# EAGLE schematic minsis arduino mcr (EAGLE 9.5.2)
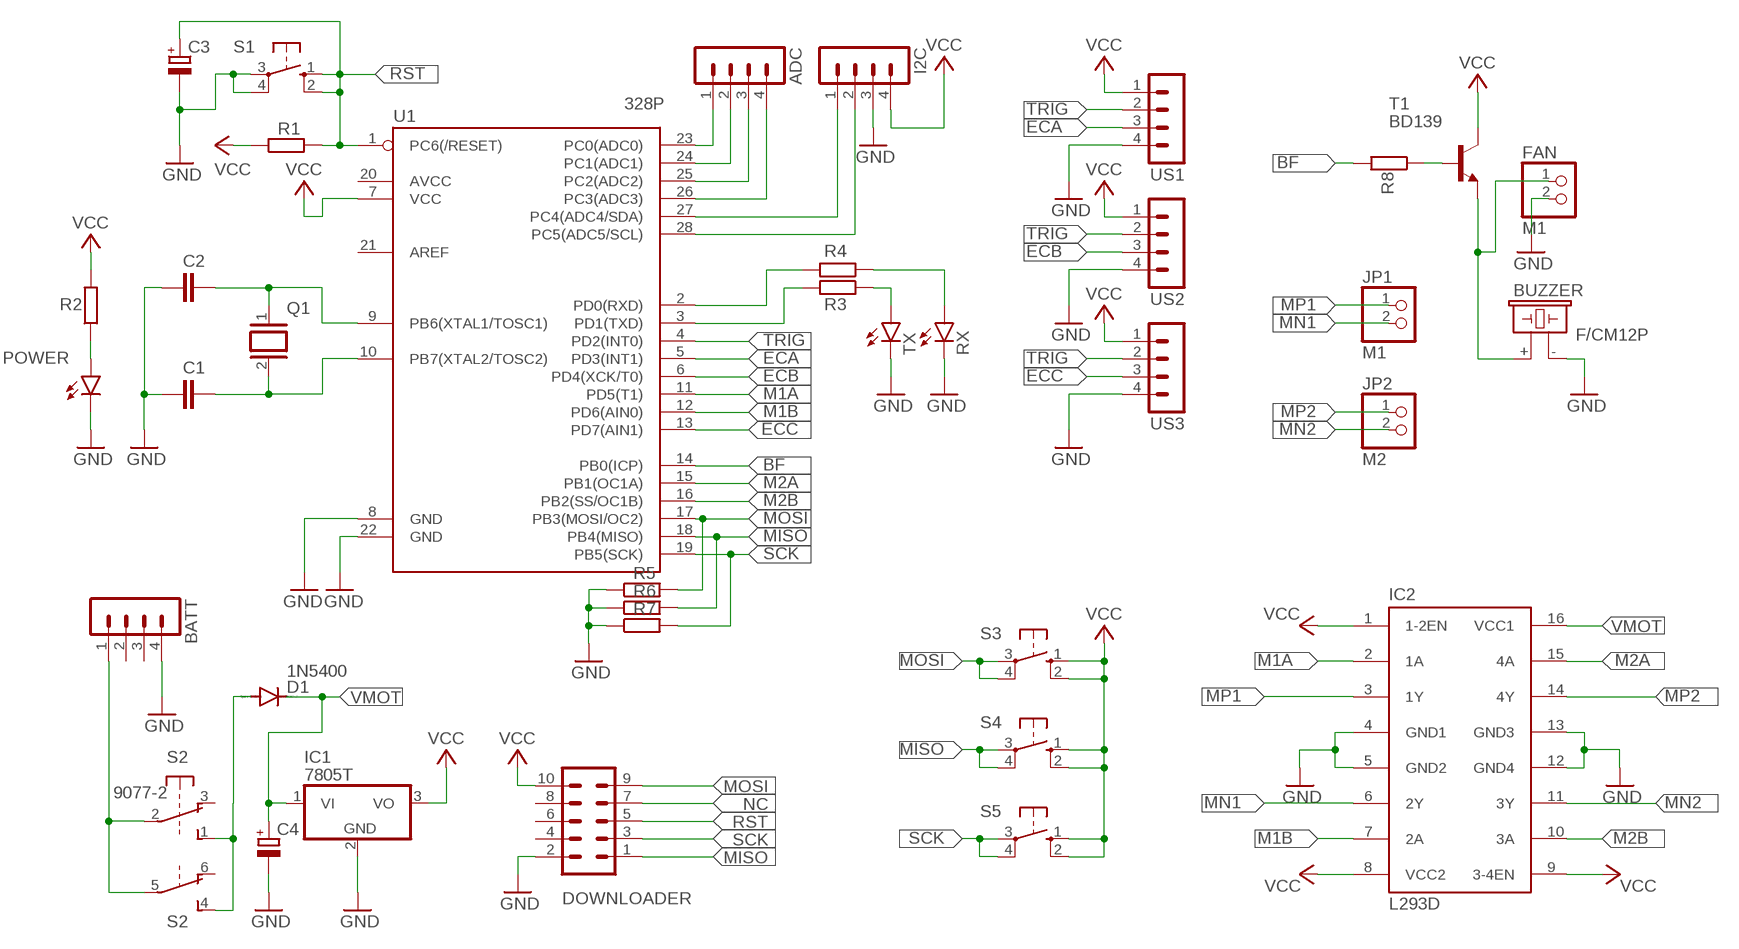
[diagram p0: schematic, sheet 1]

## Parts
ADC  MA04-1  [MA04-1]
BATT  MA04-1  [MA04-1]
BUZZER  F/CM12P  [F/CM12P]
C1  C-EU050-024X044  [C050-024X044]
C2  C-EU050-024X044  [C050-024X044]
C3  CPOL-EUE2,5-6E  [E2,5-6E]
C4  CPOL-EUE3.5-8  [E3,5-8]
D1  1N5400  [DO201-15]
DOWNLOADER  MA05-2  [MA05-2]
FAN  M1  PINHD-1X2  [1X02]
I2C  MA04-1  [MA04-1]
IC1  7805T  [TO220H]
IC2  L293D  [DIL16]
JP1  M1  PINHD-1X2  [1X02]
JP2  M2  PINHD-1X2  [1X02]
POWER  LED3MM  [LED3MM]
Q1  XTAL/S  [QS]
R1  R-EU_0207/7  [0207/7]
R2  R-EU_0207/7  [0207/7]
R3  R-EU_0207/7  [0207/7]
R4  R-EU_0207/7  [0207/7]
R5  R-EU_0207/7  [0207/7]
R6  R-EU_0207/7  [0207/7]
R7  R-EU_0207/7  [0207/7]
R8  R-EU_0207/7  [0207/7]
RX  LED3MM  [LED3MM]
S1  10-XX  [B3F-10XX]
S2  9077-2  [9077-2]
S3  10-XX  [B3F-10XX]
S4  10-XX  [B3F-10XX]
S5  10-XX  [B3F-10XX]
T1  BD139  [TO126]
TX  LED3MM  [LED3MM]
U1  328P  ATMEGA328P_PDIP  [DIP28]
US1  MA04-1  [MA04-1]
US2  MA04-1  [MA04-1]
US3  MA04-1  [MA04-1]

## Nets
BF: R8.2 U1.14(PB0(ICP))
ECA: U1.5(PD3(INT1)) US1.3
ECB: U1.6(PD4(XCK/T0)) US2.3
ECC: U1.13(PD7(AIN1)) US3.3
GND: BATT.4 BUZZER.- C1.1 C2.1 C3.- C4.- DOWNLOADER.2 FAN.2 I2C.3 IC1.2(GND) IC2.4(GND1) IC2.5(GND2) IC2.12(GND4) IC2.13(GND3) POWER.K(C) R5.1 R6.1 R7.1 RX.K(C) S1.3(P) S1.4(P1) TX.K(C) U1.8(GND) U1.22(GND) US1.4 US2.4 US3.4
M1A: IC2.2(1A) U1.11(PD5(T1))
M1B: IC2.7(2A) U1.12(PD6(AIN0))
M2A: IC2.15(4A) U1.15(PB1(OC1A))
M2B: IC2.10(3A) U1.16(PB2(SS/OC1B))
MISO: DOWNLOADER.1 R6.2 S4.3(P) S4.4(P1) U1.18(PB4(MISO))
MN1: IC2.6(2Y) JP1.2
MN2: IC2.11(3Y) JP2.2
MOSI: DOWNLOADER.9 R5.2 S3.3(P) S3.4(P1) U1.17(PB3(MOSI/OC2))
MP1: IC2.3(1Y) JP1.1
MP2: IC2.14(4Y) JP2.1
N$1: R4.1 RX.A
N$2: R3.1 TX.A
N$3: R4.2 U1.2(PD0(RXD))
N$4: R3.2 U1.3(PD1(TXD))
N$5: POWER.A R2.1
N$6: C2.2 Q1.1 U1.9(PB6(XTAL1/TOSC1))
N$7: C1.2 Q1.2 U1.10(PB7(XTAL2/TOSC2))
N$13: BATT.1 S2.2(1:P) S2.5(2:P)
N$22: D1.A S2.1(1:S) S2.4(2:S)
N$23: BUZZER.+ FAN.1 T1.1(E)
N$24: R8.1 T1.3(B)
N$28: ADC.1 U1.23(PC0(ADC0))
N$29: ADC.2 U1.24(PC1(ADC1))
N$30: ADC.3 U1.25(PC2(ADC2))
N$31: ADC.4 U1.26(PC3(ADC3))
N$32: I2C.1 U1.27(PC4(ADC4/SDA))
N$33: I2C.2 U1.28(PC5(ADC5/SCL))
NC: DOWNLOADER.7
RST: C3.+ DOWNLOADER.5 R1.2 S1.1(S) S1.2(S1) U1.1(PC6(/RESET))
SCK: DOWNLOADER.3 R7.2 S5.3(P) S5.4(P1) U1.19(PB5(SCK))
TRIG: U1.4(PD2(INT0)) US1.2 US2.2 US3.2
VCC: DOWNLOADER.10 I2C.4 IC1.3(VO) IC2.1(1-2EN) IC2.8(VCC2) IC2.9(3-4EN) R1.1 R2.2 S3.1(S) S3.2(S1) S4.1(S) S4.2(S1) S5.1(S) S5.2(S1) T1.2(C) U1.7(VCC) US1.1 US2.1 US3.1
VMOT: C4.+ D1.C IC1.1(VI) IC2.16(VCC1)
Unconnected: BATT.2 BATT.3 DOWNLOADER.4 DOWNLOADER.6 DOWNLOADER.8 S2.3(1:O) S2.6(2:O) U1.20(AVCC) U1.21(AREF)

## Library data of the parts
ADC BATT I2C US1-US3 = con-lstb:MA04-1: PIN HEADER; OC_FARNELL: unknown; OC_NEWARK: unknown
BUZZER = buzzer:F/CM12P: BUZZER Source: Buerklin; OC_FARNELL: unknown; OC_NEWARK: unknown
C1 C2 = rcl:C-EU: CAPACITOR, European symbol; SPICEPREFIX: C
C3 C4 = rcl:CPOL-EU: POLARIZED CAPACITOR, European symbol; SPICEPREFIX: C
D1 = diode:1N5400: DIODE standard rectifier, 3 A, 50 V (Motorola)
DOWNLOADER = con-lstb:MA05-2: PIN HEADER; OC_FARNELL: unknown; OC_NEWARK: unknown
FAN JP1 JP2 = Connector:PINHD-1X2: PIN HEADER; CATEGORY: CONNECTOR; SUB-CATEGORY: PIN-HEADER
IC1 = linear:78*: Positive VOLTAGE REGULATOR Source: http://cache.national.com/ds/LM/LM78L05.pdf http://www.fairchildsemi.com/ds/LM/LM7805.pdf
IC2 = st-microelectronics:L293D: PUSH-PULL 4 CHANNEL DRIVER; MPN: L293D; OC_FARNELL: 9589619; OC_NEWARK: 56P8249
POWER RX TX = led:LED: LED OSRAM: - CHIPLED LG R971, LG N971, LY N971, LG Q971, LY Q971, LO R971, LY R971 LH N974, LH R974 LS Q976, LO Q976, LY Q976 LO Q996 - Hyper CHIPLED LW Q18S LB Q993, LB Q99A, LB R99A - SideLED LS A670, LO A670, LY A670, LG A670, LP A670 LB A673, LV A673, LT A673, LW A673 LH A674 LY A675 LS A676, LA A676, LO A676, LY A676, LW A676 LS A679, LY A679, LG A679 - Hyper Micro SIDELED® LS Y876, LA Y876, LO Y876, LY Y876 LT Y87S - SmartLED LW L88C, LW L88S LB L89C, LB L89S, LG L890 LS L89K, LO L89K, LY L89K LS L896, LA L896, LO L896, LY L896 - TOPLED LS T670, LO T670, LY T670, LG T670, LP T670 LSG T670, LSP T670, LSY T670, LOP T670, LYG T670 LG T671, LOG T671, LSG T671 LB T673, LV T673, LT T673, LW T673 LH T674 LS T676, LA T676, LO T676, LY T676, LB T676, LH T676, LSB T676, LW T676 LB T67C, LV T67C, LT T67C, LS T67K, LO T67K, LY T67K, LW E67C LS E67B, LA E67B, LO E67B, LY E67B, LB E67C, LV E67C, LT E67C LW T67C LS T679, LY T679, LG T679 LS T770, LO T770, LY T770, LG T770, LP T770 LB T773, LV T773, LT T773, LW T773 LH T774 LS E675, LA E675, LY E675, LS T675 LS T776, LA T776, LO T776, LY T776, LB T776 LHGB T686 LT T68C, LB T68C - Hyper Mini TOPLED® LB M676 - Mini TOPLED Santana® LG M470 LS M47K, LO M47K, LY M47K Source: http://www.osram.convergy.de LUXEON: - LUMILED® LXK2-PW12-R00, LXK2-PW12-S00, LXK2-PW14-U00, LXK2-PW14-V00 LXK2-PM12-R00, LXK2-PM12-S00, LXK2-PM14-U00 LXK2-PE12-Q00, LXK2-PE12-R00, LXK2-PE12-S00, LXK2-PE14-T00, LXK2-PE14-U00 LXK2-PB12-K00, LXK2-PB12-L00, LXK2-PB12-M00, LXK2-PB14-N00, LXK2-PB14-P00, LXK2-PB14-Q00 LXK2-PR12-L00, LXK2-PR12-M00, LXK2-PR14-Q00, LXK2-PR14-R00 LXK2-PD12-Q00, LXK2-PD12-R00, LXK2-PD12-S00 LXK2-PH12-R00, LXK2-PH12-S00 LXK2-PL12-P00, LXK2-PL12-Q00, LXK2-PL12-R00 Source: www.luxeon.com KINGBRIGHT: KA-3528ASYC Source: www.kingbright.com
Q1 = special:XTAL/S: CRYSTAL
R1-R8 = rcl:R-EU_: RESISTOR, European symbol; SPICEPREFIX: R
S1 S3-S5 = switch-omron:10-XX: OMRON SWITCH; MPN: B3F-1000; OC_FARNELL: 176432; OC_NEWARK: 36M3542
S2 = switch-misc:9077-2: MARQUARDT SWITCH 9077.0200 Distributor: Buerklin <https://www.buerklin.com/default.asp?event=ShowArtikel%2812G2822%29&l=d&jump=ArtNr_12G2822>
T1 = transistor-neu-to92:BD139: NPN TRANSISTOR
U1 = SparkFun-IC-Microcontroller:ATMEGA328P_PDIP: Atmel 328P Through hole ATMEGA328P uC used in the Arduino 32kb flash, 1k EEPROM, 2k SRAM Datasheet <http://www.sparkfun.com/datasheets/Components/SMD/ATMega328.pdf> SparkFun Products Storefront component: AVR 28 Pin 20MHz 32K 6A/D - ATMega328P <https://www.sparkfun.com/products/9061> (COM-09061) SparkFun Simon Says - Through-Hole Soldering Kit <https://www.sparkfun.com/products/10547> (KIT-10547) SparkFun Learn to Solder - Simon Says <https://www.sparkfun.com/products/13708> (KIT-13708) SparkFun BigTime Watch Kit <https://www.sparkfun.com/products/11734> (KIT-11734) SparkFun ClockIt <https://www.sparkfun.com/products/10930> (KIT-10930) SparkFun Serial Enabled LCD Kit <https://www.sparkfun.com/products/10097> (LCD-10097) SparkFun Simon Tilts - Through Hole Soldering Kit <https://www.sparkfun.com/products/12634> (KIT-12634) SparkFun Frequency Counter Kit <https://www.sparkfun.com/products/10140> (KIT-10140) FabFM Radio Kit <https://www.sparkfun.com/products/11043> (KIT-11043) SparkFun Binary Blaster Kit <https://www.sparkfun.com/products/12037> (KIT-12037) SparkFun Metro-Gnome <https://www.sparkfun.com/products/9236> (KIT-09236) ATmega328 with Arduino Optiboot (Uno) <https://www.sparkfun.com/products/10524> (DEV-10524); PROD_ID: IC-09136